# EAGLE design transducer_array (EAGLE 9.6.2)
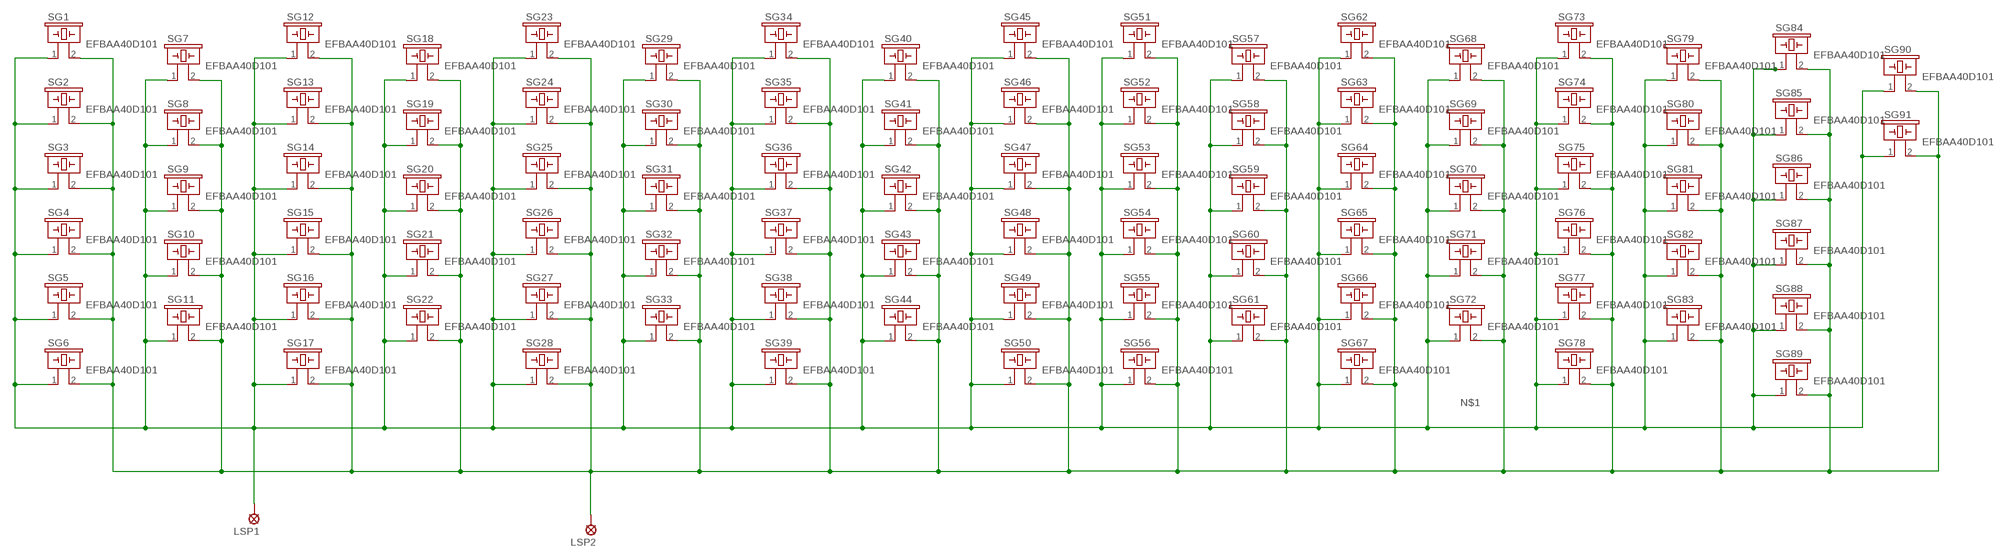
[diagram p0: schematic, sheet 1]

## Parts
LSP1  LSP10  [LSP10]
LSP2  LSP10  [LSP10]
SG1  EFBAA40D101  [EFBAA40D101]
SG2  EFBAA40D101  [EFBAA40D101]
SG3  EFBAA40D101  [EFBAA40D101]
SG4  EFBAA40D101  [EFBAA40D101]
SG5  EFBAA40D101  [EFBAA40D101]
SG6  EFBAA40D101  [EFBAA40D101]
SG7  EFBAA40D101  [EFBAA40D101]
SG8  EFBAA40D101  [EFBAA40D101]
SG9  EFBAA40D101  [EFBAA40D101]
SG10  EFBAA40D101  [EFBAA40D101]
SG11  EFBAA40D101  [EFBAA40D101]
SG12  EFBAA40D101  [EFBAA40D101]
SG13  EFBAA40D101  [EFBAA40D101]
SG14  EFBAA40D101  [EFBAA40D101]
SG15  EFBAA40D101  [EFBAA40D101]
SG16  EFBAA40D101  [EFBAA40D101]
SG17  EFBAA40D101  [EFBAA40D101]
SG18  EFBAA40D101  [EFBAA40D101]
SG19  EFBAA40D101  [EFBAA40D101]
SG20  EFBAA40D101  [EFBAA40D101]
SG21  EFBAA40D101  [EFBAA40D101]
SG22  EFBAA40D101  [EFBAA40D101]
SG23  EFBAA40D101  [EFBAA40D101]
SG24  EFBAA40D101  [EFBAA40D101]
SG25  EFBAA40D101  [EFBAA40D101]
SG26  EFBAA40D101  [EFBAA40D101]
SG27  EFBAA40D101  [EFBAA40D101]
SG28  EFBAA40D101  [EFBAA40D101]
SG29  EFBAA40D101  [EFBAA40D101]
SG30  EFBAA40D101  [EFBAA40D101]
SG31  EFBAA40D101  [EFBAA40D101]
SG32  EFBAA40D101  [EFBAA40D101]
SG33  EFBAA40D101  [EFBAA40D101]
SG34  EFBAA40D101  [EFBAA40D101]
SG35  EFBAA40D101  [EFBAA40D101]
SG36  EFBAA40D101  [EFBAA40D101]
SG37  EFBAA40D101  [EFBAA40D101]
SG38  EFBAA40D101  [EFBAA40D101]
SG39  EFBAA40D101  [EFBAA40D101]
SG40  EFBAA40D101  [EFBAA40D101]
SG41  EFBAA40D101  [EFBAA40D101]
SG42  EFBAA40D101  [EFBAA40D101]
SG43  EFBAA40D101  [EFBAA40D101]
SG44  EFBAA40D101  [EFBAA40D101]
SG45  EFBAA40D101  [EFBAA40D101]
SG46  EFBAA40D101  [EFBAA40D101]
SG47  EFBAA40D101  [EFBAA40D101]
SG48  EFBAA40D101  [EFBAA40D101]
SG49  EFBAA40D101  [EFBAA40D101]
SG50  EFBAA40D101  [EFBAA40D101]
SG51  EFBAA40D101  [EFBAA40D101]
SG52  EFBAA40D101  [EFBAA40D101]
SG53  EFBAA40D101  [EFBAA40D101]
SG54  EFBAA40D101  [EFBAA40D101]
SG55  EFBAA40D101  [EFBAA40D101]
SG56  EFBAA40D101  [EFBAA40D101]
SG57  EFBAA40D101  [EFBAA40D101]
SG58  EFBAA40D101  [EFBAA40D101]
SG59  EFBAA40D101  [EFBAA40D101]
SG60  EFBAA40D101  [EFBAA40D101]
SG61  EFBAA40D101  [EFBAA40D101]
SG62  EFBAA40D101  [EFBAA40D101]
SG63  EFBAA40D101  [EFBAA40D101]
SG64  EFBAA40D101  [EFBAA40D101]
SG65  EFBAA40D101  [EFBAA40D101]
SG66  EFBAA40D101  [EFBAA40D101]
SG67  EFBAA40D101  [EFBAA40D101]
SG68  EFBAA40D101  [EFBAA40D101]
SG69  EFBAA40D101  [EFBAA40D101]
SG70  EFBAA40D101  [EFBAA40D101]
SG71  EFBAA40D101  [EFBAA40D101]
SG72  EFBAA40D101  [EFBAA40D101]
SG73  EFBAA40D101  [EFBAA40D101]
SG74  EFBAA40D101  [EFBAA40D101]
SG75  EFBAA40D101  [EFBAA40D101]
SG76  EFBAA40D101  [EFBAA40D101]
SG77  EFBAA40D101  [EFBAA40D101]
SG78  EFBAA40D101  [EFBAA40D101]
SG79  EFBAA40D101  [EFBAA40D101]
SG80  EFBAA40D101  [EFBAA40D101]
SG81  EFBAA40D101  [EFBAA40D101]
SG82  EFBAA40D101  [EFBAA40D101]
SG83  EFBAA40D101  [EFBAA40D101]
SG84  EFBAA40D101  [EFBAA40D101]
SG85  EFBAA40D101  [EFBAA40D101]
SG86  EFBAA40D101  [EFBAA40D101]
SG87  EFBAA40D101  [EFBAA40D101]
SG88  EFBAA40D101  [EFBAA40D101]
SG89  EFBAA40D101  [EFBAA40D101]
SG90  EFBAA40D101  [EFBAA40D101]
SG91  EFBAA40D101  [EFBAA40D101]

## Nets
N$1: LSP1.MP SG1.1 SG2.1 SG3.1 SG4.1 SG5.1 SG6.1 SG7.1 SG8.1 SG9.1 SG10.1 SG11.1 SG12.1 SG13.1 SG14.1 SG15.1 SG16.1 SG17.1 SG18.1 SG19.1 SG20.1 SG21.1 SG22.1 SG23.1 SG24.1 SG25.1 SG26.1 SG27.1 SG28.1 SG29.1 SG30.1 SG31.1 SG32.1 SG33.1 SG34.1 SG35.1 SG36.1 SG37.1 SG38.1 SG39.1 SG40.1 SG41.1 SG42.1 SG43.1 SG44.1 SG45.1 SG46.1 SG47.1 SG48.1 SG49.1 SG50.1 SG51.1 SG52.1 SG53.1 SG54.1 SG55.1 SG56.1 SG57.1 SG58.1 SG59.1 SG60.1 SG61.1 SG62.1 SG63.1 SG64.1 SG65.1 SG66.1 SG67.1 SG68.1 SG69.1 SG70.1 SG71.1 SG72.1 SG73.1 SG74.1 SG75.1 SG76.1 SG77.1 SG78.1 SG79.1 SG80.1 SG81.1 SG82.1 SG83.1 SG84.1 SG85.1 SG86.1 SG87.1 SG88.1 SG89.1 SG90.1 SG91.1
N$10: LSP2.MP SG1.2 SG2.2 SG3.2 SG4.2 SG5.2 SG6.2 SG7.2 SG8.2 SG9.2 SG10.2 SG11.2 SG12.2 SG13.2 SG14.2 SG15.2 SG16.2 SG17.2 SG18.2 SG19.2 SG20.2 SG21.2 SG22.2 SG23.2 SG24.2 SG25.2 SG26.2 SG27.2 SG28.2 SG29.2 SG30.2 SG31.2 SG32.2 SG33.2 SG34.2 SG35.2 SG36.2 SG37.2 SG38.2 SG39.2 SG40.2 SG41.2 SG42.2 SG43.2 SG44.2 SG45.2 SG46.2 SG47.2 SG48.2 SG49.2 SG50.2 SG51.2 SG52.2 SG53.2 SG54.2 SG55.2 SG56.2 SG57.2 SG58.2 SG59.2 SG60.2 SG61.2 SG62.2 SG63.2 SG64.2 SG65.2 SG66.2 SG67.2 SG68.2 SG69.2 SG70.2 SG71.2 SG72.2 SG73.2 SG74.2 SG75.2 SG76.2 SG77.2 SG78.2 SG79.2 SG80.2 SG81.2 SG82.2 SG83.2 SG84.2 SG85.2 SG86.2 SG87.2 SG88.2 SG89.2 SG90.2 SG91.2

## Library data of the parts
LSP1 LSP2 = solpad:LSP10: SOLDER PAD drill 1.0 mm, distributor Buerklin, 12H555
SG1-SG91 = buzzer:EFB?: Piezoelectric Acoustic Transducer Source: Panbasonic .. 2SC1685.pdf; OC_FARNELL: unknown; OC_NEWARK: unknown

## Board
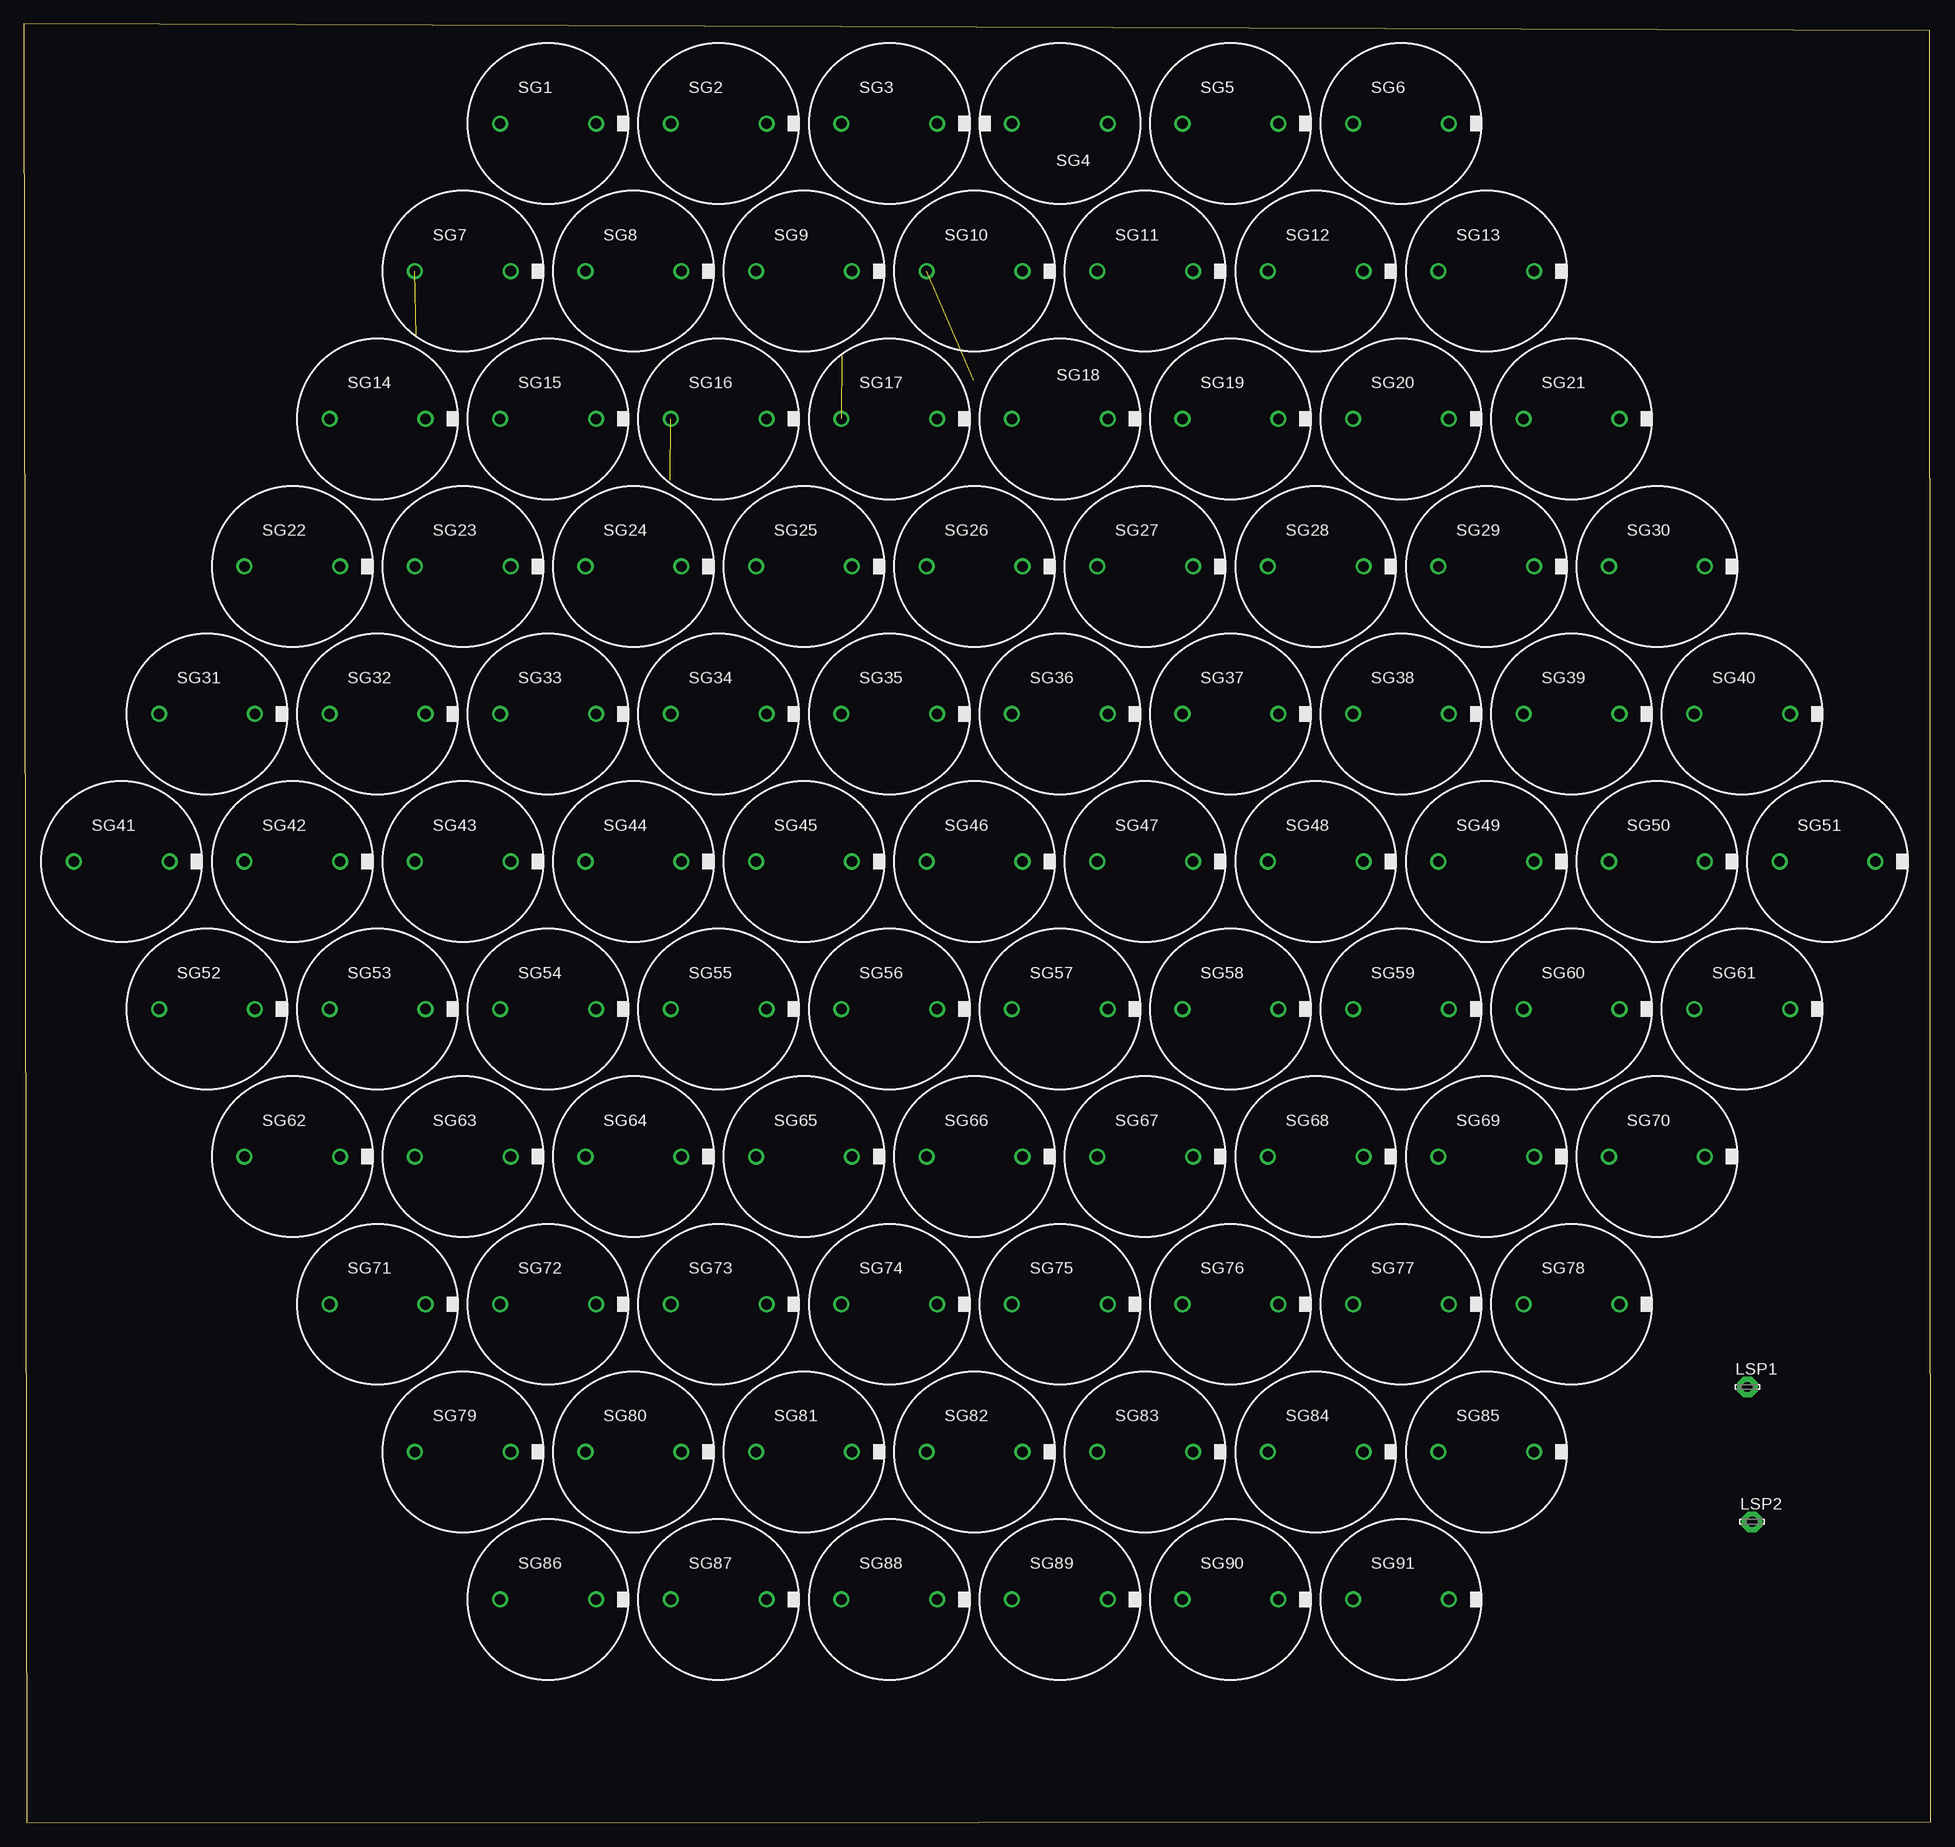
[diagram p1: board, top side]
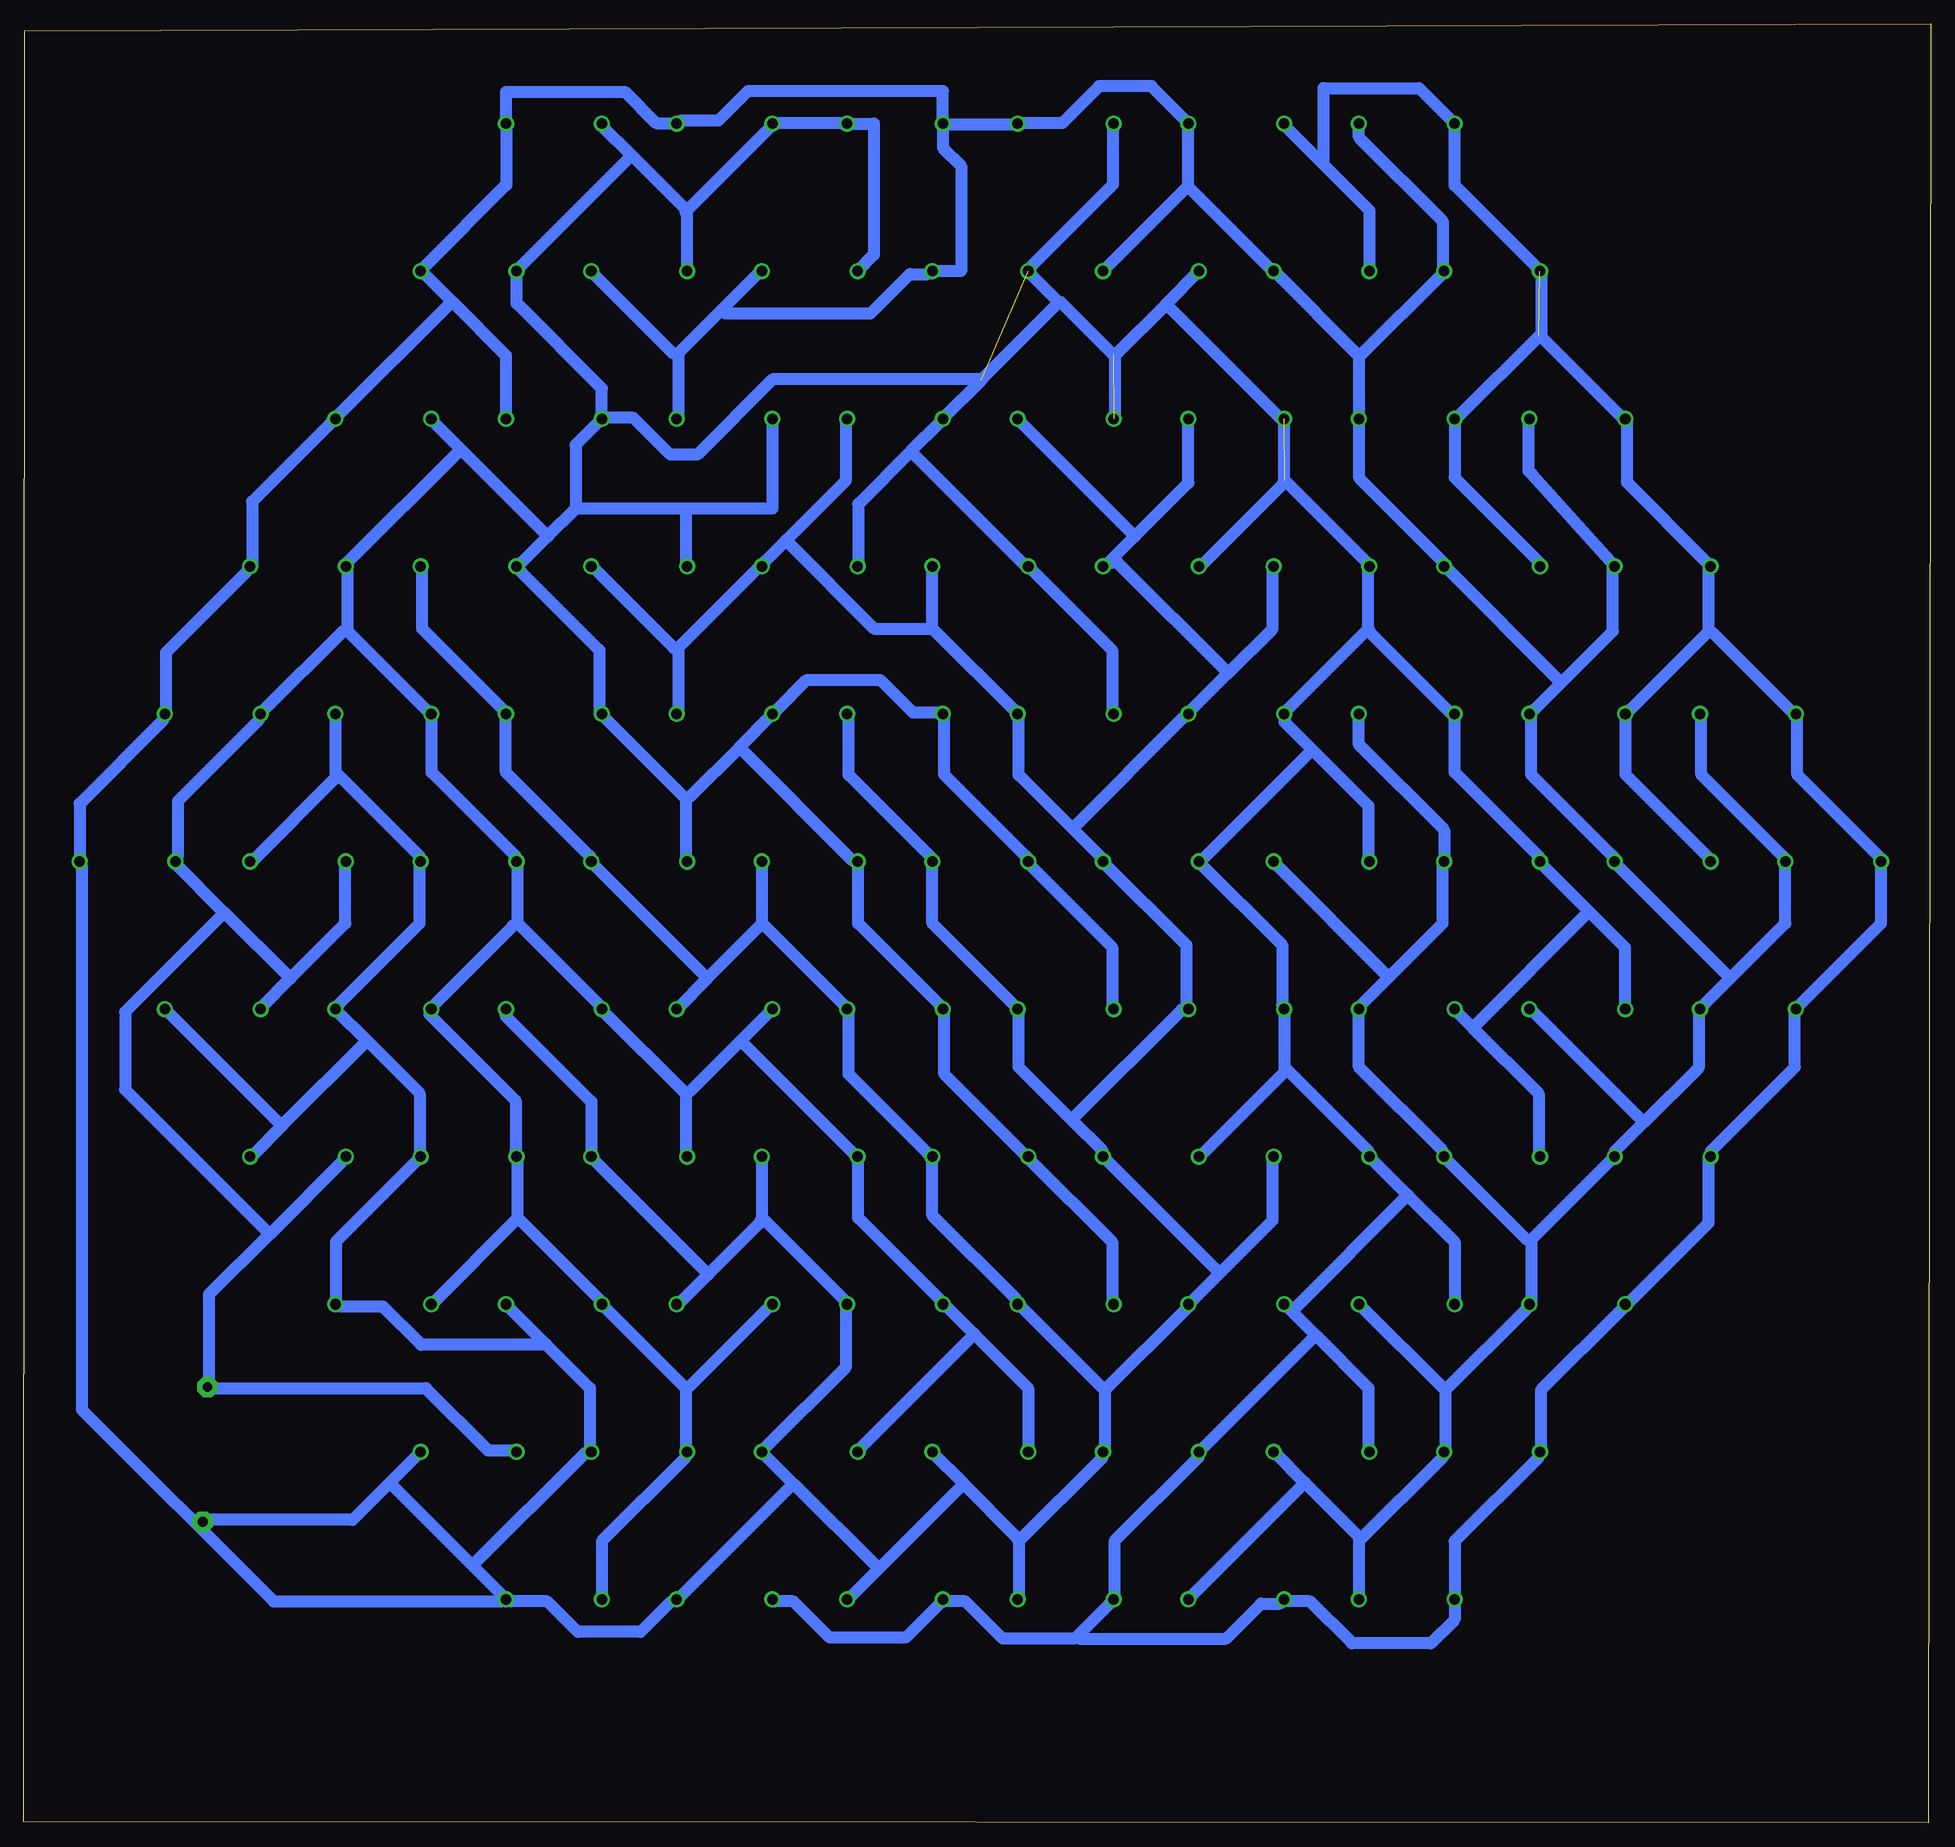
[diagram p2: board, bottom side, seen from below]

Size 199 x 187.7 mm. Coordinates in mm from the lower left corner, seen from the top.
Outline: 0.3,0 199,0.1 198.9,187 0,187.7 0.3,0
Copper layers (1*16): Top 0.035mm / dielectric 1.5mm / Bottom 0.035mm
Design rules "default *": minimum track width 1.25mm, minimum drill 0.5mm, track to track 15mil, track to pad 15mil, pad to pad 12mil, via to via 12mil, smd to smd 12mil, copper to edge 40mil, drill to drill 6mil, minimum pad ring 10mil, minimum via ring 8mil, stop-mask expansion 4mil, vias tented up to drill 0mil, thermal gap 10mil

### Footprints (pad centres in the part's own frame; a part is rotated, then mirrored left to right if it is on the bottom)
LSP10 = drill 1.016 pad 2.159 octagon: MP 0,0
EFBAA40D101 = drill 1.1 pad 1.676: 1 -5,0; 2 5,0

### Placement (x,y rotation side)
LSP1  179.84,45.47 0 top
LSP2  180.34,31.39 0 top
SG1  54.7,177.3 0 top
SG2  72.5,177.3 0 top
SG3  90.3,177.3 0 top
SG4  108.1,177.3 180 top
SG5  125.9,177.3 0 top
SG6  143.7,177.3 0 top
SG7  45.8,161.9 0 top
SG8  63.6,161.9 0 top
SG9  81.4,161.9 0 top
SG10  99.2,161.9 0 top
SG11  117,161.9 0 top
SG12  134.8,161.9 0 top
SG13  152.6,161.9 0 top
SG14  36.9,146.5 0 top
SG15  54.7,146.5 0 top
SG16  72.5,146.5 0 top
SG17  90.3,146.5 0 top
SG18  108.1,146.5 0 top
SG19  125.9,146.5 0 top
SG20  143.7,146.5 0 top
SG21  161.5,146.5 0 top
SG22  28,131.1 0 top
SG23  45.8,131.1 0 top
SG24  63.6,131.1 0 top
SG25  81.4,131.1 0 top
SG26  99.2,131.1 0 top
SG27  117,131.1 0 top
SG28  134.8,131.1 0 top
SG29  152.6,131.1 0 top
SG30  170.4,131.1 0 top
SG31  19.1,115.7 0 top
SG32  36.9,115.7 0 top
SG33  54.7,115.7 0 top
SG34  72.5,115.7 0 top
SG35  90.3,115.7 0 top
SG36  108.1,115.7 0 top
SG37  125.9,115.7 0 top
SG38  143.7,115.7 0 top
SG39  161.5,115.7 0 top
SG40  179.3,115.7 0 top
SG41  10.2,100.3 0 top
SG42  28,100.3 0 top
SG43  45.8,100.3 0 top
SG44  63.6,100.3 0 top
SG45  81.4,100.3 0 top
SG46  99.2,100.3 0 top
SG47  117,100.3 0 top
SG48  134.8,100.3 0 top
SG49  152.6,100.3 0 top
SG50  170.4,100.3 0 top
SG51  188.2,100.3 0 top
SG52  19.1,84.9 0 top
SG53  36.9,84.9 0 top
SG54  54.7,84.9 0 top
SG55  72.5,84.9 0 top
SG56  90.3,84.9 0 top
SG57  108.1,84.9 0 top
SG58  125.9,84.9 0 top
SG59  143.7,84.9 0 top
SG60  161.5,84.9 0 top
SG61  179.3,84.9 0 top
SG62  28,69.5 0 top
SG63  45.8,69.5 0 top
SG64  63.6,69.5 0 top
SG65  81.4,69.5 0 top
SG66  99.2,69.5 0 top
SG67  117,69.5 0 top
SG68  134.8,69.5 0 top
SG69  152.6,69.5 0 top
SG70  170.4,69.5 0 top
SG71  36.9,54.1 0 top
SG72  54.7,54.1 0 top
SG73  72.5,54.1 0 top
SG74  90.3,54.1 0 top
SG75  108.1,54.1 0 top
SG76  125.9,54.1 0 top
SG77  143.7,54.1 0 top
SG78  161.5,54.1 0 top
SG79  45.8,38.7 0 top
SG80  63.6,38.7 0 top
SG81  81.4,38.7 0 top
SG82  99.2,38.7 0 top
SG83  117,38.7 0 top
SG84  134.8,38.7 0 top
SG85  152.6,38.7 0 top
SG86  54.7,23.3 0 top
SG87  72.5,23.3 0 top
SG88  90.3,23.3 0 top
SG89  108.1,23.3 0 top
SG90  125.9,23.3 0 top
SG91  143.7,23.3 0 top

### Tracks (layer width: path | path; a pad name or v marks a point on that pad's centre or on a via)
N$1  (4 unrouted)
  Bottom 1.25: SG56.1 85.45,85.1 85.45,91.35 94.2,100.1 SG46.1 94.45,100.85 102.95,109.35 102.95,115.6 SG36.1 103.7,115.85 106.25,115.85 109.65,119.25 117.3,119.25 120.45,116.1 SG37.1 120.95,115.6 124.33,112.22 | 129.95,106.85 129.95,100.35 SG48.1 | 129.95,106.85 138.7,115.6 SG38.1 138.95,116.1 138.95,122.35 147.2,130.6 SG29.1 147.45,131.1 144.32,134.22 | 124.33,112.22 129.45,107.1 129.95,106.85 | SG74.1 85.45,54.1 85.45,60.6 94.2,69.35 SG66.1 94.7,69.85 102.95,78.1 102.95,84.85 SG57.1 103.45,85.35 111.95,93.85 111.95,100.1 SG47.1 112.45,100.35 124.33,112.22 | 129.95,45.35 129.95,38.85 SG84.1 129.95,38.1 138.7,29.35 SG91.1 | 129.95,45.35 SG77.1 138.95,54.6 147.45,63.1 | SG76.1 120.95,54.1 129.45,45.6 129.95,45.35 | 147.45,63.1 147.45,69.35 SG69.1 147.7,70.1 147.7,75.35 156.7,84.35 SG60.1 156.45,85.1 147.95,93.6 147.45,93.85 | 147.45,63.1 156.45,54.1 SG78.1 | 173.38,61.43 165.45,69.35 SG70.1 | 173.38,61.43 179.7,55.1 179.7,45.6 LSP1.MP 179.2,45.35 157.05,45.35 150.55,38.85 147.7,38.85 SG85.1 | SG11.1 110.3,163.6 110.3,177.3 SG4.1 113.7,177.35 120.7,177.35 SG5.1 120.9,177.15 129.85,168.2 | 129.85,168.2 129.85,161.97 SG12.1 | 135.57,173.97 138.7,177.1 SG6.1 | 135.57,173.97 129.95,168.35 129.95,168.1 129.85,168.2 | 135.57,173.97 147.45,162.1 SG13.1 147.6,158.55 138.7,149.65 SG20.1 | 129.95,137.12 129.95,131.1 SG28.1 | 141.42,137.12 144.32,134.22 | 144.32,134.22 153.42,143.32 | 153.42,143.32 156.45,146.35 SG21.1 | SG82.1 94.2,45.35 99.83,50.98 | 99.83,50.98 102.95,54.1 SG75.1 103.45,54.6 111.95,63.1 111.95,69.35 SG67.1 112.45,69.85 124.2,81.6 | 99.83,50.98 111.95,38.85 SG83.1
  Bottom 1.25: 171.2,88.1 174.2,85.1 SG61.1 | 171.2,88.1 165.45,93.85 165.45,100.1 SG50.1 | 171.2,88.1 178.07,94.97 | 178.07,94.97 183.2,100.1 SG51.1 182.95,100.85 182.95,106.6 174.45,115.1 SG40.1 174.2,115.85 165.7,124.35 165.2,124.35 | 129.95,76.1 129.95,69.6 SG68.1 | 129.95,76.1 138.7,84.85 SG59.1 138.95,85.35 147.45,93.85 | 124.2,81.6 129.45,76.35 129.95,76.1 | 124.2,81.6 SG58.1 | 147.45,93.85 147.45,100.1 SG49.1 147.7,100.85 156.45,109.6 156.45,115.6 SG39.1 156.95,116.1 165.2,124.35 | 165.2,124.35 165.2,131.1 SG30.1 165.4,131.35 153.42,143.32 | 173.38,61.43 188.45,76.5 188.45,84.6 178.07,94.97 | SG8.1 58.6,168.25 63.38,173.03 | 63.38,173.03 67.45,177.1 SG2.1 | SG23.1 40.95,131.1 40.95,131.6 49.7,140.35 SG15.1 49.2,146.85 40.95,155.1 | SG42.1 23.2,100.35 23.2,100.7 31.9,109.4 SG32.1 31.45,116.1 23.2,124.35 | 23.2,124.35 23.2,131.1 SG22.1 23.45,131.6 31.7,139.85 31.7,146.35 SG14.1 32.2,146.6 40.45,154.85 40.65,154.95 40.65,161.75 SG7.1 41.2,162.35 49.7,170.85 SG1.1 53.4,181 63.38,181 63.38,173.03 | 23.2,124.35 22.7,124.1 14.45,115.85 SG31.1 13.95,115.6 13.95,109.35 5.45,100.85 SG41.1 5.2,93.85 13.7,85.35 SG52.1 14.2,84.85 14.2,78.85 22.95,70.1 SG62.1 23.2,69.35 23.2,62.6 31.7,54.1 SG71.1 32.2,53.6 40.7,45.1 40.7,38.85 SG79.1 40.95,38.1 49.7,29.35 SG86.1 49.7,21.2 52.2,18.7 60.4,18.7 64.8,23.1 67.45,23.1 SG87.1 67.95,22.85 69.9,22.85 73.55,19.2 88.9,19.2 89.12,19.43 | SG72.1 49.7,60.6 54.58,65.47 | 54.58,65.47 SG64.1 58.7,70.1 67.45,78.85 | 67.45,78.85 67.45,84.85 SG55.1 67.7,85.35 67.7,91.6 SG45.1 76.2,100.35 64.58,111.97 | SG65.1 76.2,69.6 67.45,78.35 67.45,78.85
  Bottom 1.25: 64.2,50.85 67.45,54.1 SG73.1 66.45,53.6 54.58,65.47 | 64.2,50.85 58.7,45.35 58.7,38.85 SG80.1 | 64.2,50.85 76.2,38.85 SG81.1 76.45,38.1 85.2,29.35 85.2,23.35 SG88.1 85.7,22.85 89.12,19.43 | 89.12,19.43 89.35,19.2 96.85,19.2 100.75,23.1 102.95,23.1 SG89.1 103.45,22.85 107,19.3 114.9,19.3 118.7,23.1 120.7,23.1 SG90.1 | SG35.1 85.45,115.85 85.45,122.35 SG26.1 94.7,131.35 106.45,143.1 | SG17.1 85.15,146.65 85.15,153.25 84.95,153.35 79.83,158.47 | 91,158.65 94.2,161.85 SG10.1 93.95,162.35 85.35,170.95 85.35,177.23 SG3.1 | 91,158.65 90.95,158.6 90.85,158.7 85.32,153.17 | 79.83,158.47 SG9.1 | 91,158.65 99.05,150.6 120.9,150.6 128.75,142.75 131.55,142.75 135.4,146.6 138.2,146.6 SG20.1 | 99.12,150.53 103.1,146.55 SG18.1 103.45,146.1 106.45,143.1 | 106.45,143.1 111.95,137.6 111.95,131.1 SG27.1 | 47.83,82.97 49.7,84.85 SG54.1 | 47.83,82.97 40.95,76.1 40.95,69.6 SG63.1 | 35.7,95.1 40.7,100.1 SG43.1 40.95,100.85 49.7,109.6 SG33.1 50.2,115.85 58.45,124.1 58.7,124.6 | 35.7,95.1 31.95,91.35 31.95,85.1 SG53.1 | 35.7,95.1 47.83,82.97 | 64.58,111.97 67.45,114.85 67.45,115.6 SG34.1 67.2,116.1 58.7,124.6 | 64.58,111.97 58.7,106.1 58.7,100.35 SG44.1 | 58.7,124.6 58.7,131.1 SG24.1 58.95,131.6 67.45,140.1 | SG25.1 76.2,131.1 67.7,139.6 67.55,139.9 67.55,146.45 SG16.1 67.95,146.6 79.83,158.47 | 129.95,137.12 141.42,137.12 | 129.95,137.12 120.9,137.12 SG19.1 | SG20.1 141.42,143.78 141.42,137.12
N$10
  Bottom 1.25: 130.7,122.6 130.7,115.85 SG37.2 | 130.7,122.6 122.2,131.1 SG27.2 121.7,131.6 119.48,133.82 | 119.48,133.82 113.2,140.1 113.2,146.35 SG18.2 | SG28.2 139.7,131.1 131.2,122.6 130.7,122.6 | 73.33,119.97 77.45,115.85 SG34.2 77.95,115.35 89.58,103.72 | 73.33,119.97 68.7,124.6 68.7,131.1 SG24.2 | SG16.2 77.5,139.8 83.08,134.22 | 83.08,134.22 86.2,131.1 SG25.2 84.95,131.6 73.33,119.97 | 83.08,134.22 95.2,146.35 SG17.2 | 89.58,103.72 86.7,100.85 SG45.2 77.7,91.6 77.7,85.1 SG55.2 78.2,84.85 89.7,73.35 | 89.58,103.72 95.2,109.35 95.2,115.6 SG35.2 104.2,124.6 | 104.2,124.6 SG26.2 | 104.2,124.6 104.2,124.55 110.2,124.55 119.48,133.82 | 163.2,81.6 SG60.2 166.2,85.35 157.7,93.85 157.7,100.1 SG49.2 157.7,100.85 166.45,109.6 | 163.2,81.6 157.7,76.1 157.7,69.6 SG69.2 157.95,69.1 166.45,60.6 166.45,54.1 SG78.2 165.95,53.85 161.55,53.85 157.55,49.85 144.6,49.85 144.52,49.93 | 166.45,109.6 166.45,115.6 SG39.2 | 163.2,81.6 172.07,72.72 | 172.07,72.72 175.2,69.6 SG70.2 | SG50.2 175.2,100.35 166.45,109.1 166.45,109.6 | 172.07,72.72 184.2,84.85 SG61.2 | SG77.2 144.52,49.93 | 144.52,49.93 139.95,45.35 139.95,38.85 SG84.2 140.45,38.6 152.2,26.85 | SG85.2 160.82,35.48 | 160.82,35.48 164.7,31.6 180.2,31.6 LSP2.MP | 160.82,35.48 152.2,26.85 | 152.2,26.85 148.7,23.35 SG91.2 | 74.2,57.35 77.45,54.1 SG73.2 77.7,53.6 86.2,45.1 | 74.2,57.35 68.7,62.85 68.7,69.35 SG64.2 | 86.2,45.1 86.2,38.85 SG81.2 86.45,38.1 95.2,29.35 | 74.2,57.35 86.2,69.35 SG65.2 86.45,70.1 89.7,73.35 | 95.2,29.35 95.2,23.35 SG88.2 | 86.2,45.1 95.2,54.1 SG74.2 95.45,54.6 104.2,63.35 SG66.2 104.7,69.85 112.95,78.1 112.95,84.85 SG57.2 113.45,85.35 121.95,93.85
  Bottom 1.25: 89.7,73.35 95.2,78.85 95.2,84.85 SG56.2 95.7,85.35 104.2,93.85 SG46.2 104.45,100.85 112.95,109.35 112.95,115.6 SG36.2 | 100.95,35.35 95.45,29.85 95.2,29.35 | 100.95,35.35 104.2,38.6 SG82.2 | 100.95,35.35 109.83,26.48 | 109.83,26.48 112.95,23.35 SG89.2 | 109.83,26.48 118.7,35.35 | 118.7,35.35 121.95,38.6 SG83.2 121.7,39.1 113.2,47.6 113.2,54.1 SG75.2 113.45,54.6 121.95,63.1 | 121.95,63.1 121.95,69.35 SG67.2 | 121.95,93.85 121.95,100.1 SG47.2 | 118.7,35.35 130.7,23.35 SG90.2 131.45,23.1 134.65,19.9 141.2,19.9 144.4,23.1 148.2,23.1 SG91.2 | 127.58,57.23 122.2,62.6 121.95,63.1 | 127.58,57.23 130.7,54.1 SG76.2 | 121.95,93.85 127.7,88.1 | 127.7,88.1 SG58.2 | 127.58,57.23 139.7,69.35 SG68.2 139.8,75.25 148.7,84.15 SG59.2 | 127.7,88.1 139.7,100.1 SG48.2 139.95,100.85 148.7,109.6 SG38.2 148.95,116.1 157.45,124.6 157.45,131.1 SG29.2 | SG20.2 148.7,153.1 154.32,158.72 | 154.32,158.72 157.45,161.85 SG13.2 157.2,162.35 148.65,170.9 148.65,177.25 SG6.2 148.7,180.6 136.3,180.6 133.05,177.35 130.95,177.35 SG5.2 130.45,177.6 126.55,177.6 123.45,180.7 103.1,180.7 SG4.2 | 154.32,158.72 166.45,146.6 SG21.2 166.95,146.1 175.2,137.85 175.2,131.1 SG30.2 175.7,130.6 184.2,122.1 184.2,115.85 SG40.2 184.45,115.1 193.2,106.35 SG51.2 192.95,99.85 192.95,43.1 172.95,23.1 149.2,23.1 SG91.2 | SG4.2 103.1,174.8 101.2,172.9 101.2,161.9 SG10.2 104.7,161.6 106.55,161.6 110.65,157.5 125.8,157.5 126.17,157.88 | SG4.2 103.05,177.25 95.35,177.25 SG3.2 94.7,177.35 90.65,177.35 86.8,181.2 81.35,181.2 77.5,177.35 SG2.2 77.55,177.25 77.55,170.75 | 130.7,153.35 130.7,146.6 SG19.2 | 126.17,157.88 122.2,161.85 SG11.2
  Bottom 1.25: 126.17,157.88 130.7,153.35 | SG12.2 139.8,161.85 131.3,153.35 130.7,153.35 | SG1.2 59.7,175.9 50.95,167.15 50.95,162.1 SG7.2 50.84,161.76 59.7,152.9 | 59.7,152.9 SG15.2 59.65,146.42 59.65,140.3 50.95,131.6 SG23.2 50.7,131.1 38.58,118.97 | 59.7,152.9 59.7,153.1 68.45,161.85 SG8.2 68.7,161.9 77.55,170.75 | 77.55,170.75 SG9.2 | 41.7,60.85 41.7,54.1 SG71.2 42.2,53.6 50.7,45.1 | 41.7,60.85 33.2,69.35 SG62.2 32.95,70.1 29.95,73.1 | 29.95,73.1 24.2,78.85 24.2,84.85 SG52.2 23.7,85.35 20.95,88.1 | 29.95,73.1 41.7,84.85 SG53.2 | 50.7,45.1 50.7,38.85 SG79.2 50.95,38.1 59.7,29.35 | 41.7,60.85 42.2,60.85 50.7,69.35 SG63.2 50.95,70.1 59.7,78.85 SG54.2 59.45,85.35 56.58,88.22 | 59.7,29.35 SG86.2 | 65.33,35.48 59.7,29.85 59.7,29.35 | 65.33,35.48 68.45,38.6 SG80.2 | 50.7,45.1 SG72.2 | 65.33,35.48 SG87.2 | 20.95,88.1 15.2,93.85 SG41.2 15.45,100.85 23.95,109.35 23.95,115.6 SG31.2 | 20.95,88.1 32.95,100.1 SG42.2 33.2,100.85 41.7,109.35 41.7,115.6 SG32.2 41.45,116.1 38.58,118.97 | 56.58,88.22 50.95,93.85 50.95,100.1 SG43.2 50.8,103.6 59.7,112.5 SG33.2 | 56.58,88.22 68.45,100.1 SG44.2 | 38.58,118.97 33.2,124.35 33.2,131.1 SG22.2 41.7,140.77 42,141.07 42,146.4 SG14.2